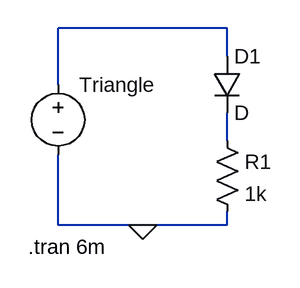
[diagram p0: schematic Diode1.asc]
Diode1.asc, the LTspice schematic file:
Version 4
SHEET 1 880 680
WIRE 176 0 -16 0
WIRE 176 32 176 0
WIRE -16 64 -16 0
WIRE 176 128 176 96
WIRE -16 224 -16 144
WIRE 80 224 -16 224
WIRE 176 224 176 208
WIRE 176 224 80 224
FLAG 80 224 0
SYMBOL res 160 112 R0
SYMATTR InstName R1
SYMATTR Value 1k
SYMBOL diode 160 32 R0
SYMATTR InstName D1
SYMBOL voltage -16 48 R0
WINDOW 3 24 96 Invisible 2
WINDOW 123 0 0 Left 0
WINDOW 39 0 0 Left 0
SYMATTR InstName Triangle
SYMATTR Value PULSE(-2 2 0 0.5m 0.5m 1p 1m)
TEXT -50 248 Left 2 !.tran 6m

The netlist it stands for:
* Diode1.asc
R1 N002 0 1k
D1 N001 N002 D
V§Triangle N001 0 PULSE(-2 2 0 0.5m 0.5m 1p 1m)
.model D D
.lib standard.dio
.tran 6m
.backanno
.end